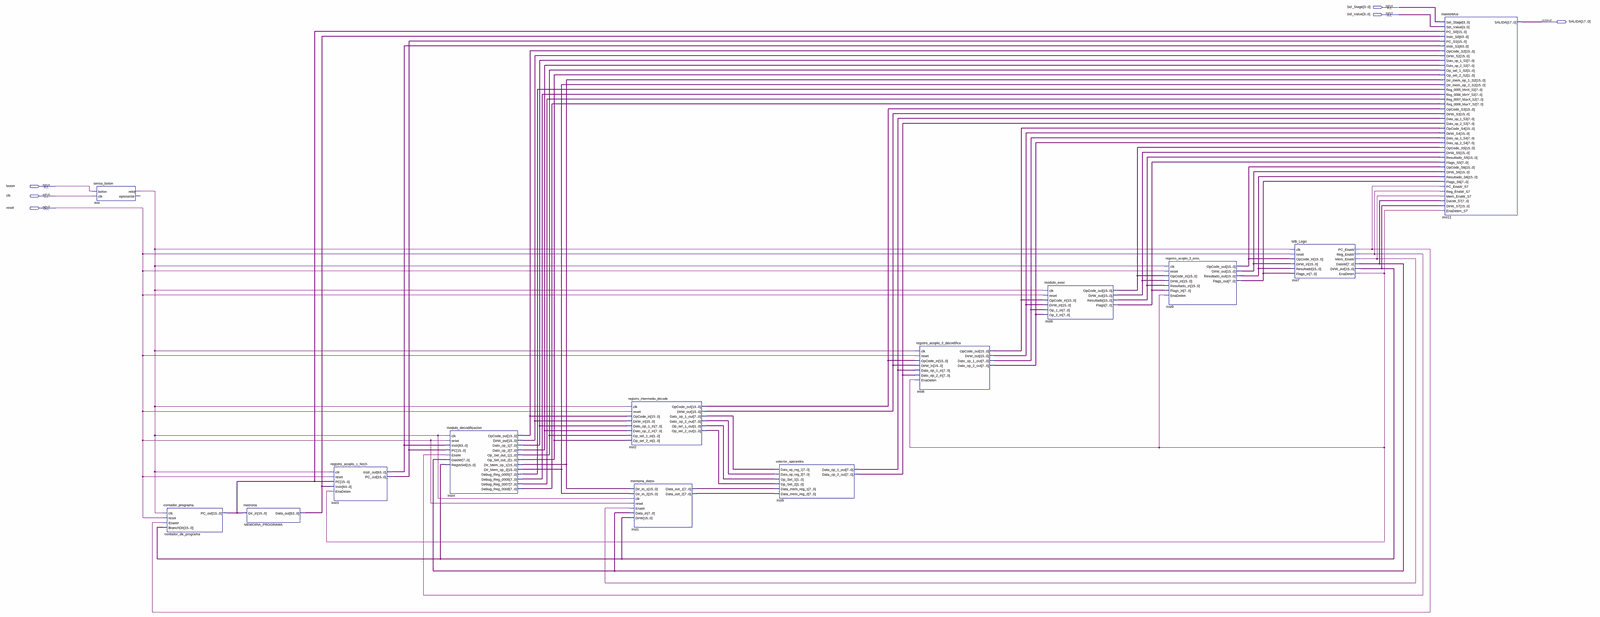
[diagram p0: schematic sheet, whole]
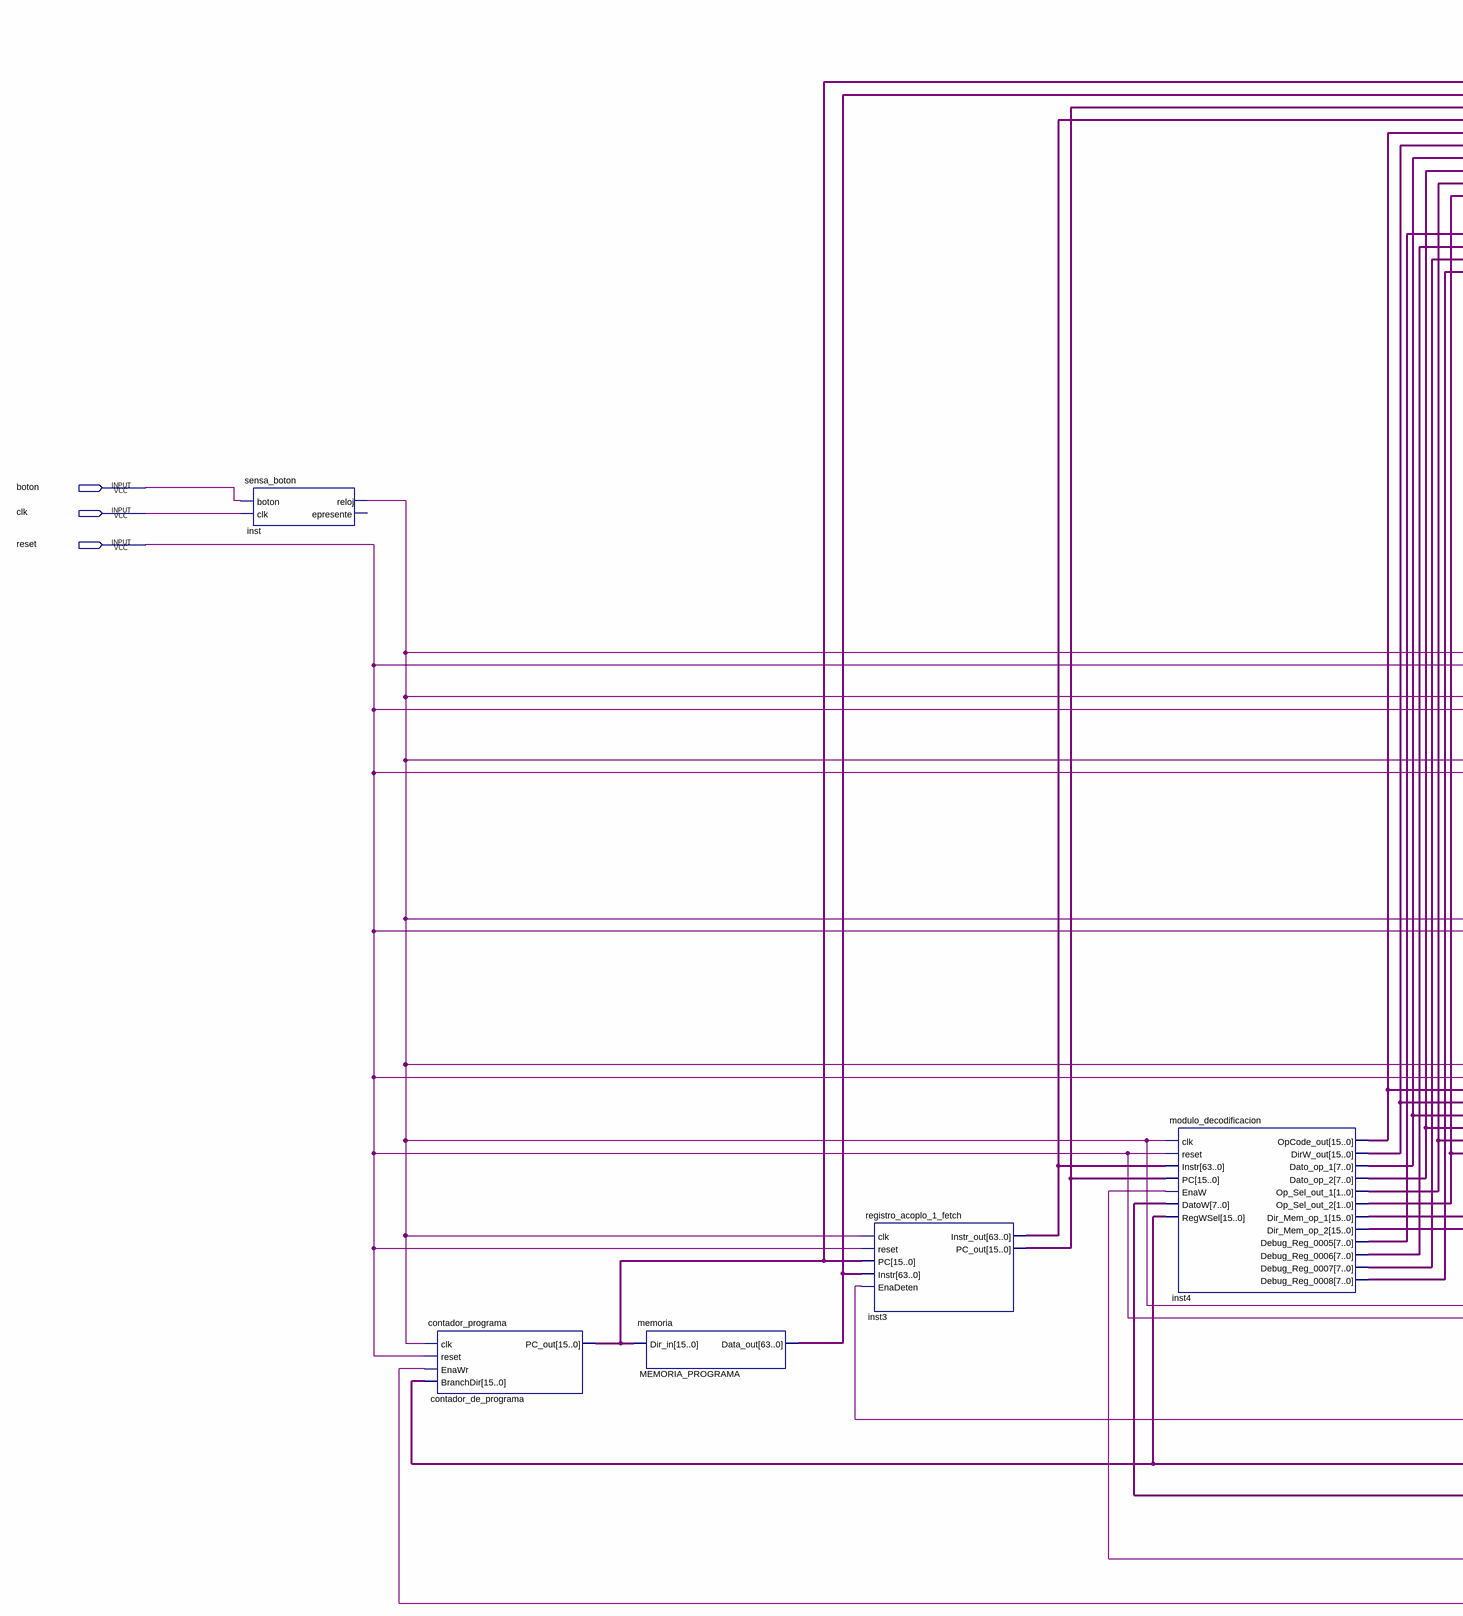
[diagram p1: schematic sheet, left part]
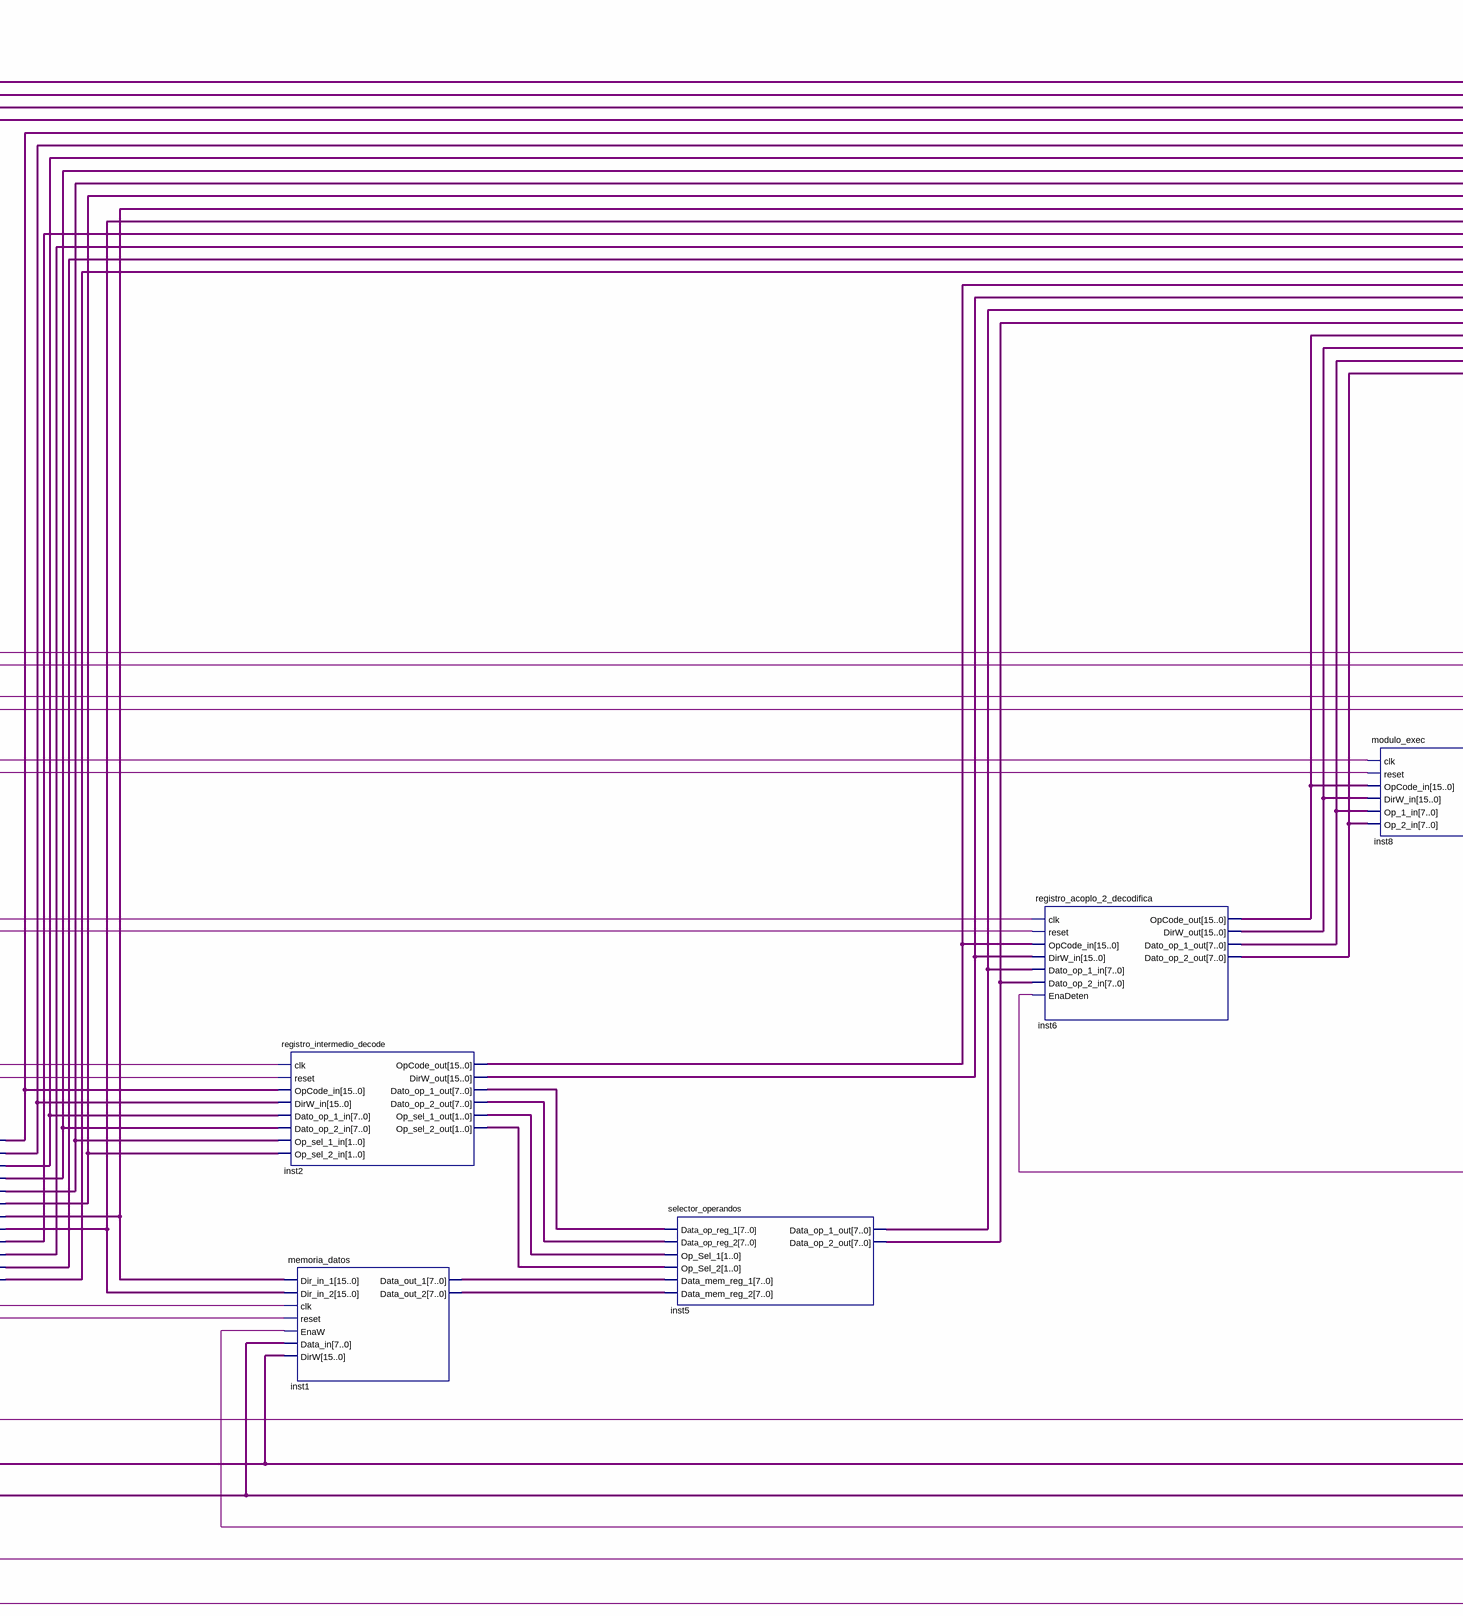
[diagram p2: schematic sheet, centre part]
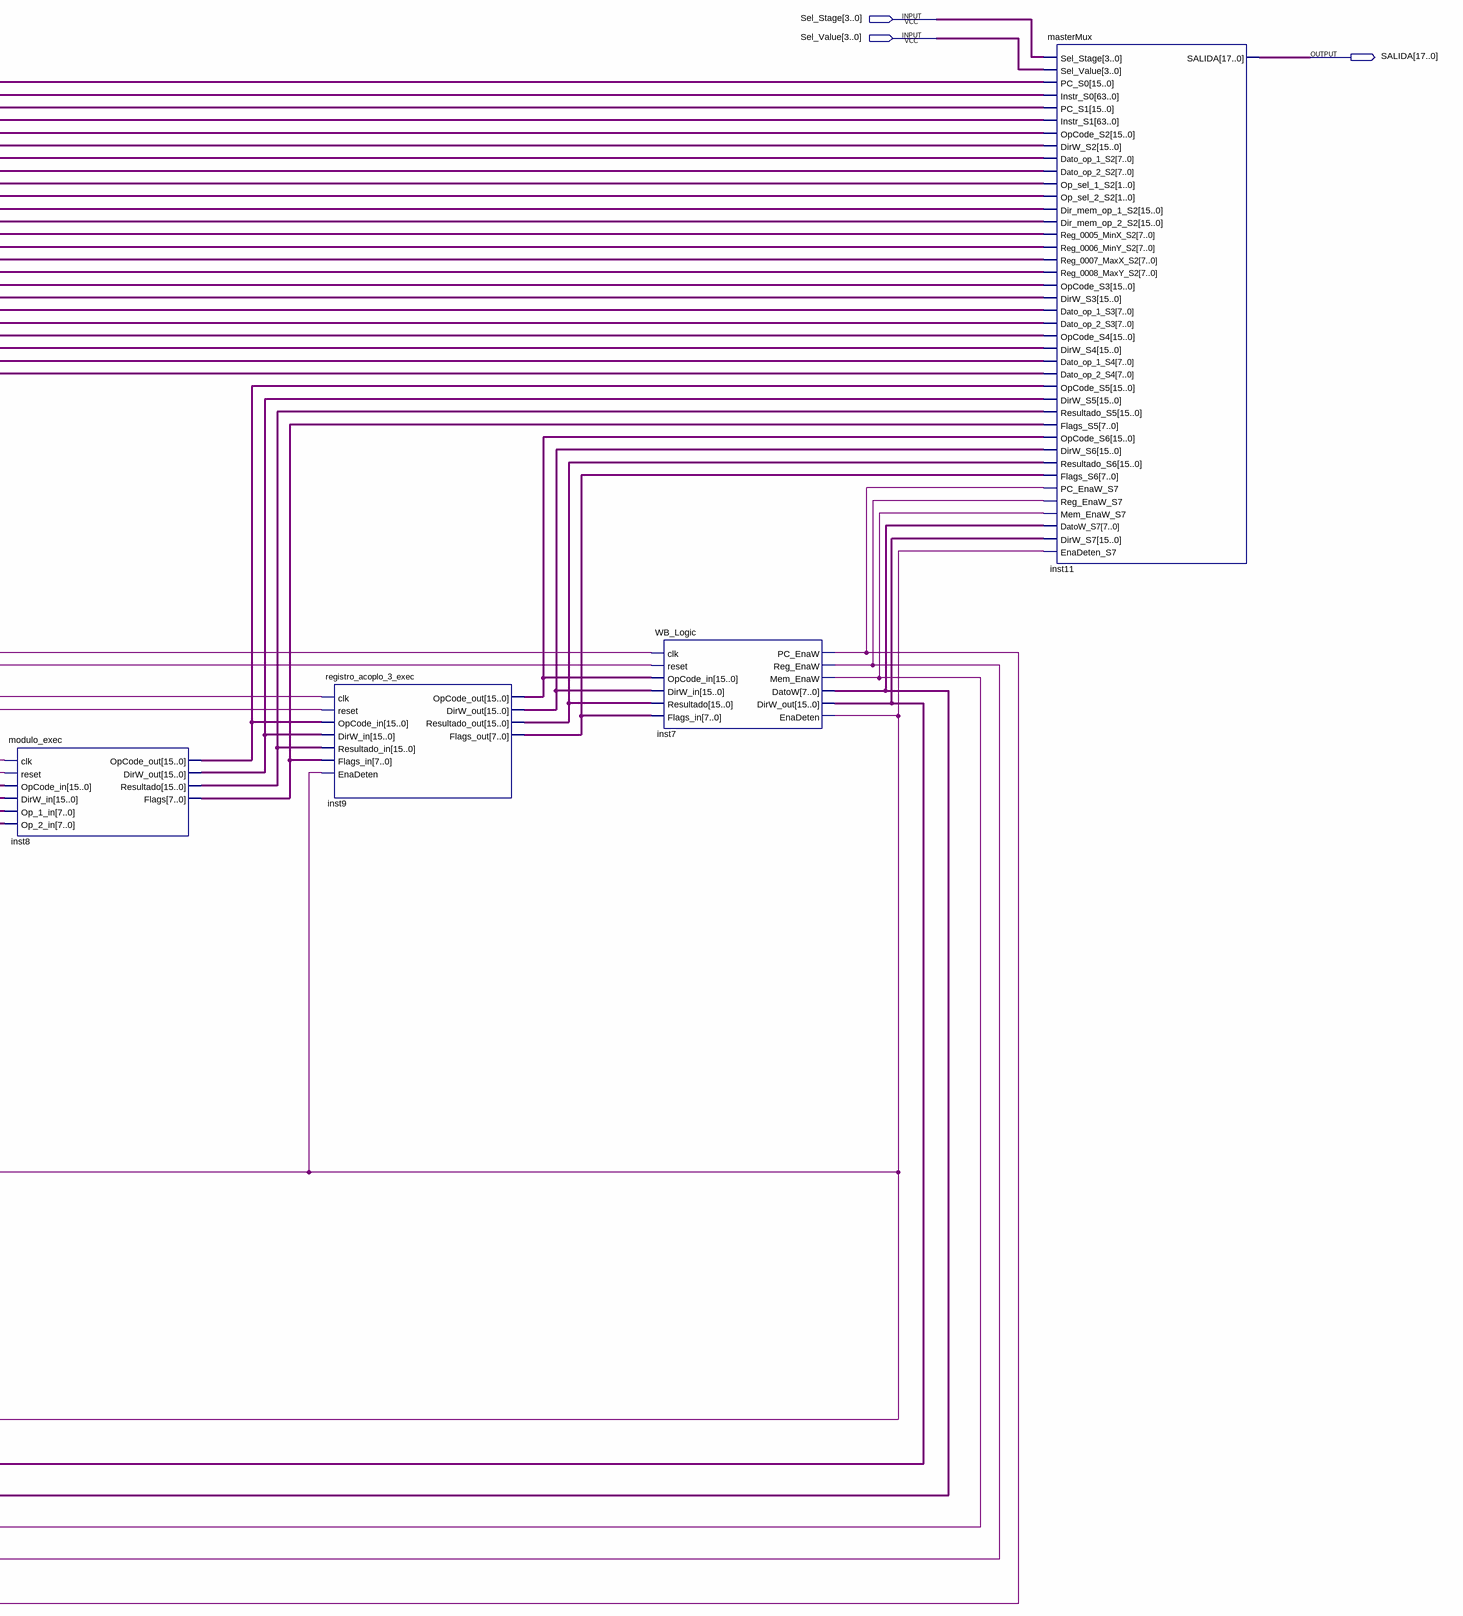
[diagram p3: schematic sheet, right part]
// Quartus schematic ProyectoFinal.bdf as structural Verilog: 13 symbols, 6 pins
module ProyectoFinal (
  input  [3:0] Sel_Stage,
  input  [3:0] Sel_Value,
  input  boton,
  input  clk,
  input  reset,
  output [17:0] SALIDA
);

  wire inst7_enadeten, inst7_mem_enaw, inst7_pc_enaw, inst7_reg_enaw, inst_reloj;
  wire [1:0] inst2_op_sel_1_out, inst2_op_sel_2_out, inst4_op_sel_out_1, inst4_op_sel_out_2;
  wire [7:0] inst1_data_out_1, inst1_data_out_2, inst2_dato_op_1_out, inst2_dato_op_2_out, inst4_dato_op_1,
       inst4_dato_op_2, inst4_debug_reg_0005, inst4_debug_reg_0006, inst4_debug_reg_0007,
       inst4_debug_reg_0008, inst5_data_op_1_out, inst5_data_op_2_out, inst6_dato_op_1_out,
       inst6_dato_op_2_out, inst7_datow, inst8_flags, inst9_flags_out;
  wire [15:0] contador_de_programa_pc_out, inst2_dirw_out, inst2_opcode_out, inst3_pc_out,
       inst4_dir_mem_op_1, inst4_dir_mem_op_2, inst4_dirw_out, inst4_opcode_out, inst6_dirw_out,
       inst6_opcode_out, inst7_dirw_out, inst8_dirw_out, inst8_opcode_out, inst8_resultado, inst9_dirw_out,
       inst9_opcode_out, inst9_resultado_out;
  wire [63:0] inst3_instr_out, MEMORIA_PROGRAMA_data_out;

  sensa_boton inst (.boton(boton), .clk(clk), .reloj(inst_reloj));  // open: epresente
  contador_programa contador_de_programa (
    .clk(inst_reloj), .reset(reset), .EnaWr(inst7_pc_enaw), .BranchDir(inst7_dirw_out),
    .PC_out(contador_de_programa_pc_out));
  memoria MEMORIA_PROGRAMA (.Dir_in(contador_de_programa_pc_out), .Data_out(MEMORIA_PROGRAMA_data_out));
  registro_acoplo_1_fetch inst3 (
    .clk(inst_reloj), .reset(reset), .PC(contador_de_programa_pc_out), .Instr(MEMORIA_PROGRAMA_data_out),
    .EnaDeten(inst7_enadeten), .Instr_out(inst3_instr_out), .PC_out(inst3_pc_out));
  modulo_decodificacion inst4 (
    .clk(inst_reloj), .reset(reset), .Instr(inst3_instr_out), .PC(inst3_pc_out), .EnaW(inst7_reg_enaw),
    .DatoW(inst7_datow), .RegWSel(inst7_dirw_out), .OpCode_out(inst4_opcode_out), .DirW_out(inst4_dirw_out),
    .Dato_op_1(inst4_dato_op_1), .Dato_op_2(inst4_dato_op_2), .Op_Sel_out_1(inst4_op_sel_out_1),
    .Op_Sel_out_2(inst4_op_sel_out_2), .Dir_Mem_op_1(inst4_dir_mem_op_1), .Dir_Mem_op_2(inst4_dir_mem_op_2),
    .Debug_Reg_0005(inst4_debug_reg_0005), .Debug_Reg_0006(inst4_debug_reg_0006),
    .Debug_Reg_0007(inst4_debug_reg_0007), .Debug_Reg_0008(inst4_debug_reg_0008));
  registro_intermedio_decode inst2 (
    .clk(inst_reloj), .reset(reset), .OpCode_in(inst4_opcode_out), .DirW_in(inst4_dirw_out),
    .Dato_op_1_in(inst4_dato_op_1), .Dato_op_2_in(inst4_dato_op_2), .Op_sel_1_in(inst4_op_sel_out_1),
    .Op_sel_2_in(inst4_op_sel_out_2), .OpCode_out(inst2_opcode_out), .DirW_out(inst2_dirw_out),
    .Dato_op_1_out(inst2_dato_op_1_out), .Dato_op_2_out(inst2_dato_op_2_out),
    .Op_sel_1_out(inst2_op_sel_1_out), .Op_sel_2_out(inst2_op_sel_2_out));
  memoria_datos inst1 (
    .Dir_in_1(inst4_dir_mem_op_1), .Dir_in_2(inst4_dir_mem_op_2), .clk(inst_reloj), .reset(reset),
    .EnaW(inst7_mem_enaw), .Data_in(inst7_datow), .DirW(inst7_dirw_out), .Data_out_1(inst1_data_out_1),
    .Data_out_2(inst1_data_out_2));
  selector_operandos inst5 (
    .Data_op_reg_1(inst2_dato_op_1_out), .Data_op_reg_2(inst2_dato_op_2_out), .Op_Sel_1(inst2_op_sel_1_out),
    .Op_Sel_2(inst2_op_sel_2_out), .Data_mem_reg_1(inst1_data_out_1), .Data_mem_reg_2(inst1_data_out_2),
    .Data_op_1_out(inst5_data_op_1_out), .Data_op_2_out(inst5_data_op_2_out));
  registro_acoplo_2_decodifica inst6 (
    .clk(inst_reloj), .reset(reset), .OpCode_in(inst2_opcode_out), .DirW_in(inst2_dirw_out),
    .Dato_op_1_in(inst5_data_op_1_out), .Dato_op_2_in(inst5_data_op_2_out), .EnaDeten(inst7_enadeten),
    .OpCode_out(inst6_opcode_out), .DirW_out(inst6_dirw_out), .Dato_op_1_out(inst6_dato_op_1_out),
    .Dato_op_2_out(inst6_dato_op_2_out));
  modulo_exec inst8 (
    .clk(inst_reloj), .reset(reset), .OpCode_in(inst6_opcode_out), .DirW_in(inst6_dirw_out),
    .Op_1_in(inst6_dato_op_1_out), .Op_2_in(inst6_dato_op_2_out), .OpCode_out(inst8_opcode_out),
    .DirW_out(inst8_dirw_out), .Resultado(inst8_resultado), .Flags(inst8_flags));
  registro_acoplo_3_exec inst9 (
    .clk(inst_reloj), .reset(reset), .OpCode_in(inst8_opcode_out), .DirW_in(inst8_dirw_out),
    .Resultado_in(inst8_resultado), .Flags_in(inst8_flags), .EnaDeten(inst7_enadeten),
    .OpCode_out(inst9_opcode_out), .DirW_out(inst9_dirw_out), .Resultado_out(inst9_resultado_out),
    .Flags_out(inst9_flags_out));
  WB_Logic inst7 (
    .clk(inst_reloj), .reset(reset), .OpCode_in(inst9_opcode_out), .DirW_in(inst9_dirw_out),
    .Resultado(inst9_resultado_out), .Flags_in(inst9_flags_out), .PC_EnaW(inst7_pc_enaw),
    .Reg_EnaW(inst7_reg_enaw), .Mem_EnaW(inst7_mem_enaw), .DatoW(inst7_datow), .DirW_out(inst7_dirw_out),
    .EnaDeten(inst7_enadeten));
  masterMux inst11 (
    .Sel_Stage(Sel_Stage), .Sel_Value(Sel_Value), .PC_S0(contador_de_programa_pc_out),
    .Instr_S0(MEMORIA_PROGRAMA_data_out), .PC_S1(inst3_pc_out), .Instr_S1(inst3_instr_out),
    .OpCode_S2(inst4_opcode_out), .DirW_S2(inst4_dirw_out), .Dato_op_1_S2(inst4_dato_op_1),
    .Dato_op_2_S2(inst4_dato_op_2), .Op_sel_1_S2(inst4_op_sel_out_1), .Op_sel_2_S2(inst4_op_sel_out_2),
    .Dir_mem_op_1_S2(inst4_dir_mem_op_1), .Dir_mem_op_2_S2(inst4_dir_mem_op_2),
    .Reg_0005_MinX_S2(inst4_debug_reg_0005), .Reg_0006_MinY_S2(inst4_debug_reg_0006),
    .Reg_0007_MaxX_S2(inst4_debug_reg_0007), .Reg_0008_MaxY_S2(inst4_debug_reg_0008),
    .OpCode_S3(inst2_opcode_out), .DirW_S3(inst2_dirw_out), .Dato_op_1_S3(inst5_data_op_1_out),
    .Dato_op_2_S3(inst5_data_op_2_out), .OpCode_S4(inst6_opcode_out), .DirW_S4(inst6_dirw_out),
    .Dato_op_1_S4(inst6_dato_op_1_out), .Dato_op_2_S4(inst6_dato_op_2_out), .OpCode_S5(inst8_opcode_out),
    .DirW_S5(inst8_dirw_out), .Resultado_S5(inst8_resultado), .Flags_S5(inst8_flags),
    .OpCode_S6(inst9_opcode_out), .DirW_S6(inst9_dirw_out), .Resultado_S6(inst9_resultado_out),
    .Flags_S6(inst9_flags_out), .PC_EnaW_S7(inst7_pc_enaw), .Reg_EnaW_S7(inst7_reg_enaw),
    .Mem_EnaW_S7(inst7_mem_enaw), .DatoW_S7(inst7_datow), .DirW_S7(inst7_dirw_out),
    .EnaDeten_S7(inst7_enadeten), .SALIDA(SALIDA));
endmodule
